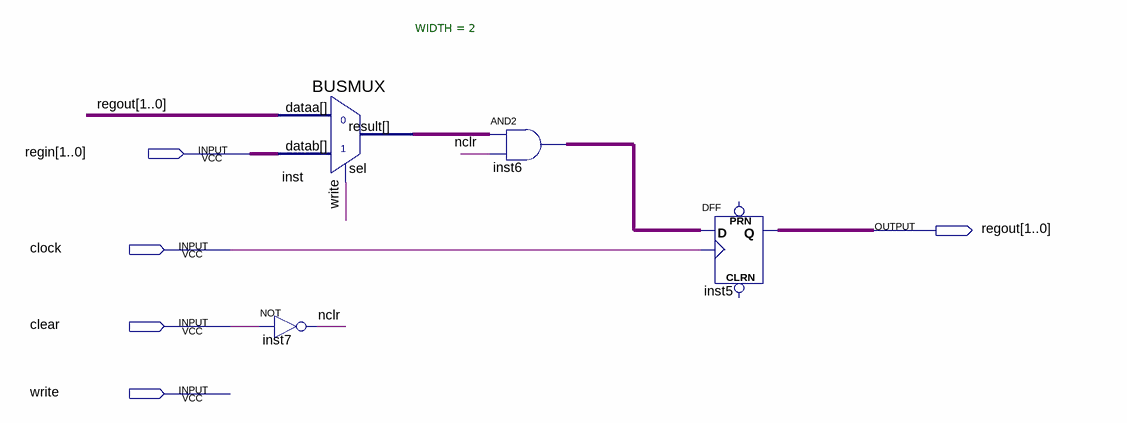
[diagram p0: schematic sheet]
// Quartus schematic Register2.bdf as structural Verilog: 4 symbols, 5 pins
module Register2 (
  input  [1:0] regin,
  input  clock,
  input  clear,
  input  write,
  output [1:0] regout
);

  wire nclr;
  wire [1:0] inst6_out, inst_result;

  not inst7 (nclr, clear);
  BUSMUX #(.WIDTH(2)) inst (.datab(regin), .sel(write), .dataa(regout), .result(inst_result));
  assign inst6_out = inst_result & {2{nclr}};  // AND2 inst6, 2 bits wide
  DFF inst5[1:0] (.CLK(clock), .D(inst6_out), .Q(regout));  // open: CLRN, PRN
endmodule
